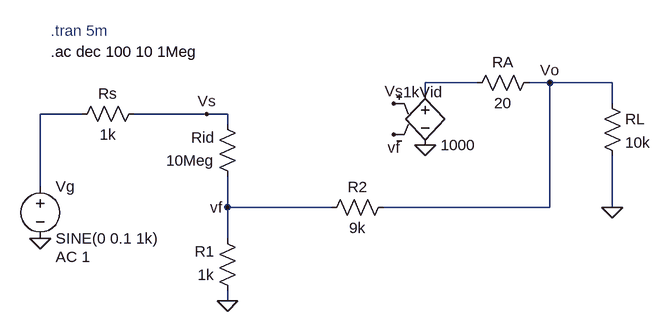
[diagram p0: schematic HW7-Exemplo1.asc]
HW7-Exemplo1.asc, the LTspice schematic file:
Version 4.1
SHEET 1 1200 800
WIRE 768 80 688 80
WIRE 880 80 848 80
WIRE 976 80 880 80
WIRE 688 96 688 80
WIRE 976 112 976 80
WIRE 160 128 96 128
WIRE 352 128 240 128
WIRE 384 128 352 128
WIRE 384 144 384 128
WIRE 96 240 96 128
WIRE 384 272 384 224
WIRE 544 272 384 272
WIRE 880 272 880 80
WIRE 880 272 624 272
WIRE 976 272 976 192
WIRE 384 320 384 272
WIRE 384 416 384 400
FLAG 96 320 0
FLAG 384 416 0
FLAG 688 176 0
FLAG 976 272 0
FLAG 352 128 Vs
FLAG 384 272 vf
FLAG 640 112 Vs
FLAG 640 160 vf
FLAG 880 80 Vo
SYMBOL res 256 112 R90
WINDOW 0 0 56 VBottom 2
WINDOW 3 32 56 VTop 2
SYMATTR InstName Rs
SYMATTR Value 1k
SYMBOL res 400 240 R180
WINDOW 0 36 76 Left 2
WINDOW 3 36 40 Left 2
SYMATTR InstName Rid
SYMATTR Value 10Meg
SYMBOL res 400 416 R180
WINDOW 0 36 76 Left 2
WINDOW 3 36 40 Left 2
SYMATTR InstName R1
SYMATTR Value 1k
SYMBOL res 528 288 R270
WINDOW 0 32 56 VTop 2
WINDOW 3 0 56 VBottom 2
SYMATTR InstName R2
SYMATTR Value 9k
SYMBOL res 752 96 R270
WINDOW 0 32 56 VTop 2
WINDOW 3 0 56 VBottom 2
SYMATTR InstName RA
SYMATTR Value 20
SYMBOL res 960 96 R0
SYMATTR InstName RL
SYMATTR Value 10k
SYMBOL voltage 96 224 R0
WINDOW 123 24 124 Left 2
WINDOW 39 0 0 Left 0
SYMATTR Value2 AC 1
SYMATTR InstName Vg
SYMATTR Value SINE(0 0.1 1k)
SYMBOL e 688 80 R0
WINDOW 0 -34 14 Left 2
SYMATTR InstName 1kVid
SYMATTR Value 1000
TEXT 112 0 Left 2 ;.tran 5m
TEXT 112 32 Left 2 !.ac dec 100 10 1Meg

The netlist it stands for:
* HW7-Exemplo1.asc
Rs Vs N002 1k
Rid vf Vs 10Meg
R1 0 vf 1k
R2 vf Vo 9k
RA N001 Vo 20
RL Vo 0 10k
Vg N002 0 SINE(0 0.1 1k) AC 1
E§1kVid N001 0 Vs vf 1000
* .tran 5m
.ac dec 100 10 1Meg
.backanno
.end